# Altium schematic sheet HiPowerProtect.SchDoc
size B; SheetNumber: 12; SheetTotal: 15
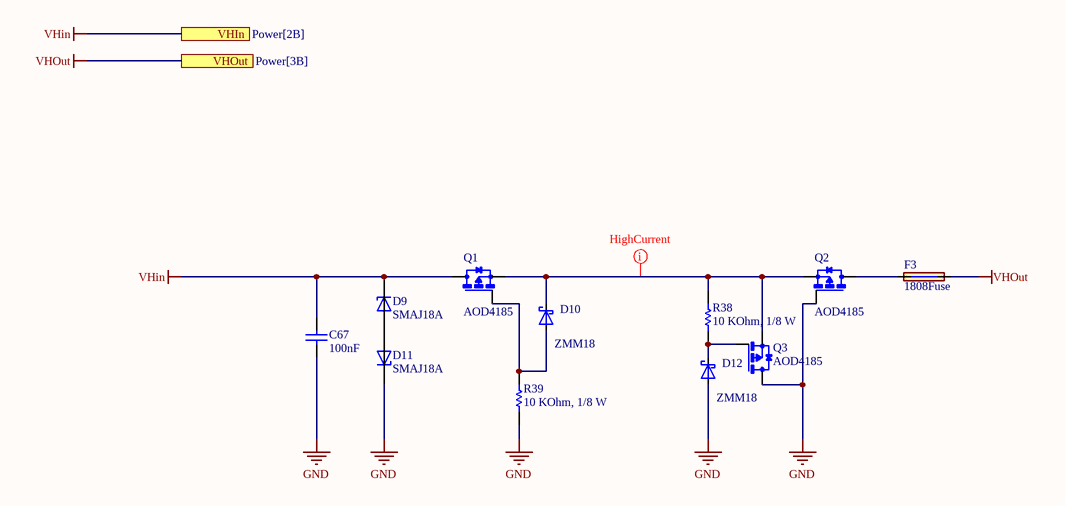
[diagram p0: HiPowerProtect.SchDoc]

## Parts
C67  value 100nF  [CAP_0805]  (hidden comment: 0108051041050)
D9  SMAJ18A  [DIOM4325X250N]
D10  ZMM18  [SOD-80_MiniMELF_Glass]
D11  SMAJ18A  [DIOM4325X250N]
D12  ZMM18  [SOD-80_MiniMELF_Glass]
F3  1808Fuse  [0154007.DR]
Q1  AOD4185  [DPAK]
Q2  AOD4185  [DPAK]
Q3  AOD4185  [DPAK]
R38  value 10 KOhm, 1/8 W  [RESISTOR_0805]  (hidden comment: 0008051031)
R39  value 10 KOhm, 1/8 W  [RESISTOR_0805]  (hidden comment: 0008051031)

## Ports
VHIn (see Power[2B]), VHOut (see Power[3B])

## Nets
GND: C67.1 D11.C D12.A Q2.1(G) Q3.4(D) R39.1
VHin: C67.2 D9.C Q1.4(D) ; port VHIn
VHOut: F3.2 ; port VHOut
NetD9_A: D9.A D11.A
NetD10_A: D10.A Q1.1(G) R39.2
NetD10_K: D10.K Q1.3(S) Q2.3(S) Q3.3(S) R38.2
NetD12_K: D12.K Q3.1(G) R38.1
NetF3_1: F3.1 Q2.4(D)

## Layout directives
rule Width Constraint [Pref Width = 50mil    Min Width = 50mil    Max Width = 100mil]: NetD10_K

## Library data of the parts
C67 = CMP-001-00259-1: CAP, size 0805, 0.1 nF, 50 VDC; Manufacture Name: TDK; Manufacture SN: CGA4J2X8R1H104K125AD; Voltage Rating DC: 50 VDC; Tolerance: 10%; Pins: 2; Supplier 2 URL: https://www.digikey.com/en/products/detail/tdk-corporation/cga4j2x8r1h104k125ad/3248169; Supplier 1 SN: 810-C2012X8R1H104KEP; Supplier 1 Name: Mouser; Supplier 3 Name: thegioiic; Mounting Technology: SMT; Source: Capacitor_0805_10_percent.SchLib; Supplier 2 SN: 445-8810-2-ND; Supplier 3 SN: OEM; Operating Temperature: -55 to +125degC; Supplier 2 Name: Digi-Key; Component Type: Standard; Design Item ID: 0108051041050; Supplier 1 URL: https://www.mouser.vn/ProductDetail/TDK/CGA4J2X8R1H104K125AD?qs=LcTL%2F5vFEzExqZqv3rh1qQ%3D%3D&utm_source=mouser-refine-download&utm_medium=file&utm_campaign=CGA4J2X8R1H104K125AD&utm_content=TDK; Supplier 3 URL: N/A; Packaging: Tape and Reel; Size: 0805
D9 D11 = CMP-004-00085-1: 400W, 21.1V, 5%, Unidirectional, TVS; MF: Taiwan Semiconductor; SnapEDA_Link: https://www.snapeda.com/parts/SMAJ18A/taiwan/view-part/?ref=snap; Value: *; Component Type: Standard; Case/Package: SMA-2 Taiwan Semiconductor; Check_prices: https://www.snapeda.com/parts/SMAJ18A/taiwan/view-part/?ref=eda; Source: SMAJ18A.SchLib; Design Item ID: SMAJ18A; Pins: 2; MP: SMAJ18A
D10 D12 = CMP-004-00086-2: Value: Shottky-Diode; Reference: D; ki_keywords: Schottky; ki_description: Schottky Diode; Component Type: Standard; Pins: 2; Source: schottky-diode.SchLib; Design Item ID: Schottky-Diode; Datasheet: https://diotec.com/de/produktliste/SBD.html
F3 = CMP-005-00062-2: Fuse 1808 with case; MF: Littelfuse Inc.; Price: None; Purchase-URL: https://pricing.snapeda.com/search?q=0154007.DR&ref=eda; Check_prices: https://www.snapeda.com/parts/0154007.DR/Littelfuse+Inc./view-part/?ref=eda; MP: 0154007.DR; Source: 0154007.DR.SchLib; Design Item ID: 0154007.DR; Case/Package: SMD-2 Littelfuse; Component Type: Standard; Pins: 2; Value: *; Availability: In Stock; SnapEDA_Link: https://www.snapeda.com/parts/0154007.DR/Littelfuse+Inc./view-part/?ref=snap
Q1-Q3 = CMP-123-000001-2: P-Channel 40V 40A (Tc) 2.5W (Ta), 62.5W (Tc) Surface Mount TO-252, (D-Pak); MF: Alpha &; Check_prices: https://www.snapeda.com/parts/AOD4185/Alpha/view-part/?ref=eda; MP: AOD4185; Package: TO-252 Alpha &amp; Omega Semiconductor; SnapEDA_Link: https://www.snapeda.com/parts/AOD4185/Alpha/view-part/?ref=snap; Design Item ID: AOD4185; Source: AOD4185.SchLib; Pin Count: 3; Value: *; Component Type: Standard
R38 R39 = CMP-009-00482-1: RES, size 0805, 10 KOhm, 1/8 W; Manufacture  Name: Vishay Dale; Manufacture  SN: CRCW080515K0FKEAC; Rated Power: 1/8 W; Resistance Tolerance: +/-1%; ComponentLink3URL: https://www.digikey.com/en/products/detail/vishay-dale/CRCW080515K0FKEAC/7928558; Supplier 3 SN: N/A; ComponentLink1URL: https://www.vishay.com/docs/28773/crcwce3.pdf; ComponentLink2Description: Supplier 1 URL; Mounting Technology: SMT; Supplier 1 SN: 71-CRCW0805-15K-E3; ComponentLink3Description: Supplier 2 URL; Pins: 2; Size: 0805; ComponentLink1Description: Datasheet link; Supplier 3 URL: N/A; Source: Resistor_0805.SchLib; Supplier 2 URL: https://www.digikey.com/en/products/detail/vishay-dale/CRCW080515K0FKEAC/7928558; ComponentLink4URL: N/A; Supplier 1 URL: https://www.mouser.vn/ProductDetail/Vishay-Dale/CRCW080515K0FKEA?qs=bMjB6bAaLEM4rXT2DoR3BA%3D%3D; Supplier 1 Name: Mouser; Design Item ID: 0008051531; Supplier 2 SN: 541-4136-2-ND; Component Type: Standard; ComponentLink2URL: https://www.mouser.vn/ProductDetail/Vishay-Dale/CRCW080515K0FKEA?qs=bMjB6bAaLEM4rXT2DoR3BA%3D%3D; Supplier 2 Name: Digi-Key; ComponentLink4Description: Supplier 3 URL; Supplier 3 Name: Thegioiic